# EAGLE design bui-001 (EAGLE 9.5.2)
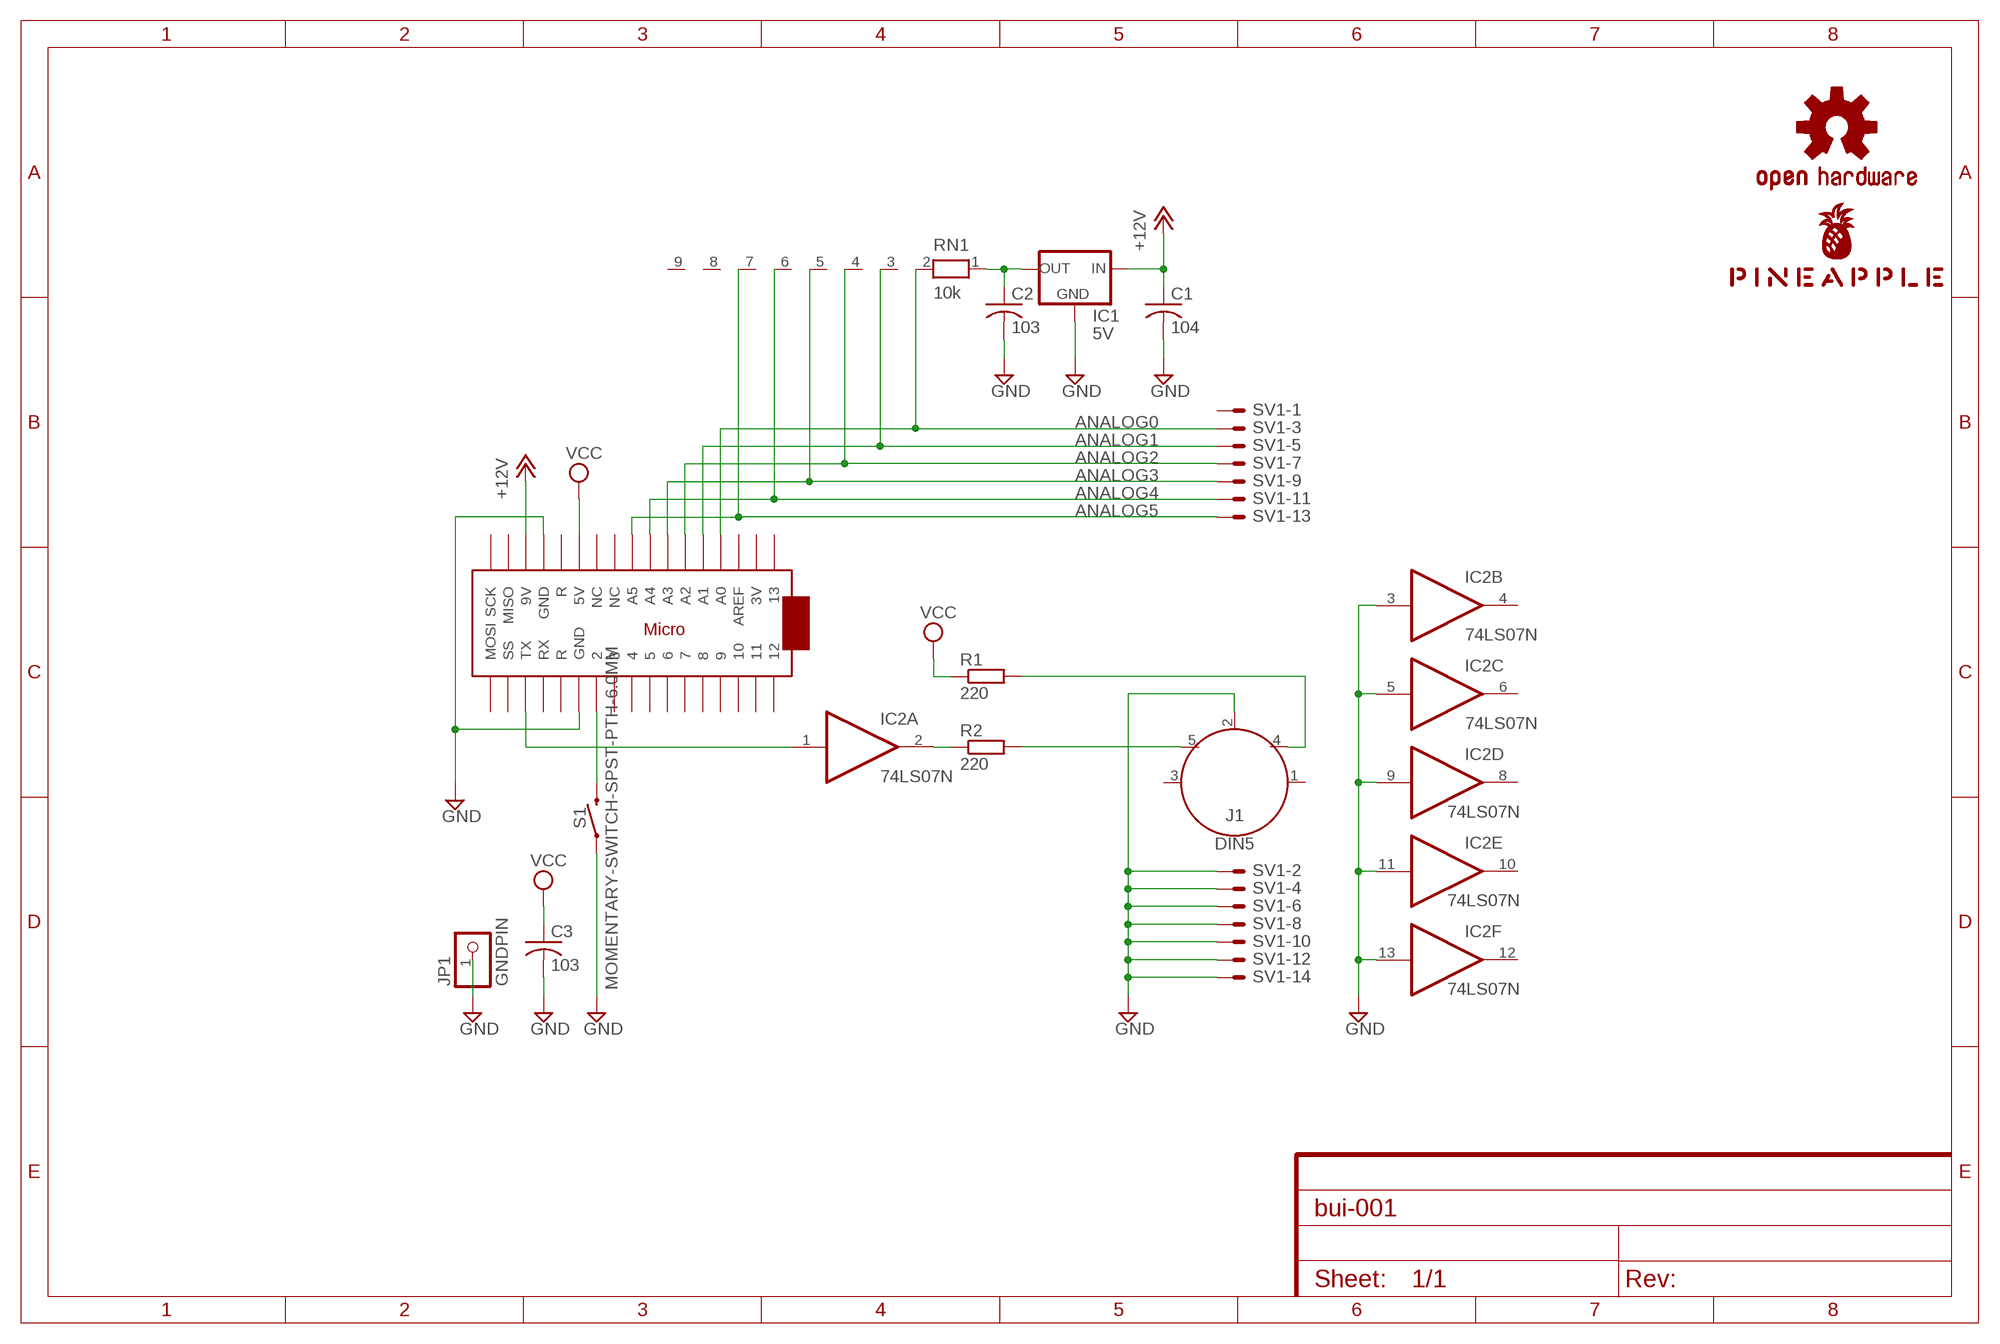
[diagram p0: schematic, sheet 1]

## Parts
C1  104  C-US025-025X050  [C025-025X050]
C2  103  C-US025-025X050  [C025-025X050]
C3  103  C-US025-025X050  [C025-025X050]
IC1  5V  78XXL  [78XXL]
IC2  74LS07N  [DIL14]
J1  DIN5  [DIN5-RA-PTH]
JP1  GNDPIN  PINHD-1X1  [1X01]
LOGO1  OSHW-LOGOS-COPPER  [OSHW-LOGO-S_COPPER]
MC1  ARDUINOMICRO  [ARDUINOMICRO]
R1  220  R-EU_0204/5  [0204/5]
R2  220  R-EU_0204/5  [0204/5]
RN1  10k  RN08  [RN-9]
S1  MOMENTARY-SWITCH-SPST-PTH-6.0MM  [TACTILE_SWITCH_PTH_6.0MM]
SV1  ML14LE  [ML14L]
U$1  PINEAPPLE450_SILK  [PINEAPPLE450_SILK]

## Nets
+12V [power]: C1.1 IC1.IN MC1.P$20(9V)
ANALOG0 [analog]: MC1.P$31(A0) RN1.2 SV1.3
ANALOG1 [analog]: MC1.P$30(A1) RN1.3 SV1.5
ANALOG2 [analog]: MC1.P$29(A2) RN1.4 SV1.7
ANALOG3 [analog]: MC1.P$28(A3) RN1.5 SV1.9
ANALOG4 [analog]: MC1.P$27(A4) RN1.6 SV1.11
ANALOG5 [analog]: MC1.P$26(A5) RN1.7 SV1.13
GND [gnd]: C1.2 C2.2 C3.2 IC1.GND IC2.3(B:I) IC2.5(C:I) IC2.9(D:I) IC2.11(E:I) IC2.13(F:I) J1.2 JP1.1 MC1.P$12(GND) MC1.P$21(GND) S1.1 SV1.2 SV1.4 SV1.6 SV1.8 SV1.10 SV1.12 SV1.14
N$1: MC1.P$11 S1.3
N$7: IC2.1(A:I) MC1.P$15(TX)
N$8: IC2.2(A:O) R2.1
N$9: J1.5 R2.2
N$10: J1.4 R1.2
VCC [power]: C3.1 MC1.P$23(5V) R1.1
VOUT [power]: C2.1 IC1.OUT RN1.1
Unconnected: IC2.4(B:O) IC2.6(C:O) IC2.8(D:O) IC2.10(E:O) IC2.12(F:O) J1.1 J1.3 MC1.P$1 MC1.P$2 MC1.P$3 MC1.P$4 MC1.P$5 MC1.P$6 MC1.P$7 MC1.P$8 MC1.P$9 MC1.P$10 MC1.P$13(R) MC1.P$14(RX) MC1.P$16(SS) MC1.P$17(MOSI) MC1.P$18(SCK) MC1.P$19(MISO) MC1.P$22(R) MC1.P$24(NC) MC1.P$25(NC) MC1.P$32(AREF) MC1.P$33(3V) MC1.P$34 RN1.8 RN1.9 SV1.1

## Power pins joined to a net without a drawn wire
GND: IC2.7(P:GND)
VCC: IC2.14(P:VCC)

## Library data of the parts
C1-C3 = rcl:C-US: CAPACITOR, American symbol
IC1 = v-reg:78XXL: VOLTAGE REGULATOR
IC2 = 74xx-us:74*07: Hex BUFFER, open collector high-voltage output
J1 = SparkFun-Connectors:DIN5: DIN5 Connector - Female Right Angle (frequently used as a MIDI Jack connector) This type of connector and cable is frequently used for transmitting midi data (musical instrument digital interface). It is what you usually see on a keyboard or set of electronic drums. Learn more here <https://en.wikipedia.org/wiki/MIDI>. For more information on the pinout and electrical specifications of MIDI communications, please see the following resource: https://www.midi.org/specifications/item/midi-din-electrical-specification Here is the connector we sell at SparkFun: MIDI Connector - Female Right Angle <https://www.sparkfun.com/products/9536> (PRT-09536) Datasheet <hhttp://www.sparkfun.com/datasheets/Prototyping/Connectors/MIDI-RA.pdf> It is used on this SparkFun product: SparkFun MIDI Shield <https://www.sparkfun.com/products/12898> (DEV-12898); PROD_ID: CONN-09481
JP1 = pinhead:PINHD-1X1: PIN HEADER
LOGO1 = SparkFun-Aesthetics:OSHW-LOGO: Open-Source Hardware (OSHW) Logo This logo indicates the piece of hardware it is found on incorporates a OSHW license and/or adheres to the definition of open source hardware found here: http://freedomdefined.org/OSHW
MC1 = adafruit:ARDUINOMICRO
R1 R2 = resistor:R-EU_: RESISTOR, European symbol
RN1 = resistor-net:RN08: RESISTOR NETWORK; OC_FARNELL: unknown; OC_NEWARK: unknown
S1 = SparkFun-Switches:MOMENTARY-SWITCH-SPST: Momentary Switch (Pushbutton) - SPST Normally-open (NO) SPST momentary switches (buttons, pushbuttons). Variants PTH-12MM - 12mm square, through-hole Momentary Pushbutton Switch - 12mm Square <https://www.sparkfun.com/products/9190> (COM-09190) PTH-6.0MM, PTH-6.0MM-KIT - 6.0mm square, through-hole Mini Pushbutton Switch <https://www.sparkfun.com/products/97> (COM-00097) KIT package intended for soldering kit's - only one side of pads' copper is exposed. PTH-RIGHT-ANGLE-KIT - Right-angle, through-hole Right Angle Tactile Button <https://www.sparkfun.com/products/10791> - Used on SparkFun BigTime Watch Kit <https://www.sparkfun.com/products/11734> SMD-12MM - 12mm square, surface-mount Tactile Button - SMD (12mm) <https://www.sparkfun.com/products/12993> (COM-12993) Used on SparkFun PicoBoard <https://www.sparkfun.com/products/11888> SMD-4.5MM - 4.5mm Square Trackball Switch Used on SparkFun Blackberry Trackballer Breakout <https://www.sparkfun.com/products/13169> SMD-4.6MMX2.8MM - 4.60mm x 2.80mm, surface mount Used on SparkFun SAMD21 Mini Breakout <https://www.sparkfun.com/products/13664> SMD-5.2MM, SMD-5.2-REDUNDANT - 5.2mm square, surface-mount Mini Pushbutton Switch - SMD <https://www.sparkfun.com/products/8720> (COM-08720) Used on Arduino Pro Mini <https://www.sparkfun.com/products/11114> REDUNDANT package connects both switch circuits together SMD-6.0X3.5MM - 6.0 x 3.5mm, surface mount Momentary Reset Switch SMD <https://www.sparkfun.com/products/8229> (COM-08229) SMD-6.2MM-TALL - 6.2mm square, surface mount Tactile Button - SMD (6mm) <https://www.sparkfun.com/products/12992> Used on SparkFun Digital Sandbox <https://www.sparkfun.com/products/12651> SMD-RIGHT-ANGLE - Right-angle, surface mount Used on SparkFun Block for Intel® Edison - Arduino <https://www.sparkfun.com/products/13036>; PROD_ID: SWCH-08441; SF_SKU: COM-00097
SV1 = con-ml:ML14LE: HARTING; OC_FARNELL: unknown; OC_NEWARK: unknown
U$1 = pineapple:PINEAPPLE450_SILK

## Net classes
0 default: width 0.152 mm, drill 0.152 mm, clearance 0.152 mm
1 gnd: width 0.61 mm, drill 0.152 mm, clearance 0.152 mm
2 power: width 0.61 mm, drill 0.152 mm, clearance 0.152 mm
3 analog: width 0.305 mm, drill 0.152 mm, clearance 0.152 mm

## Board
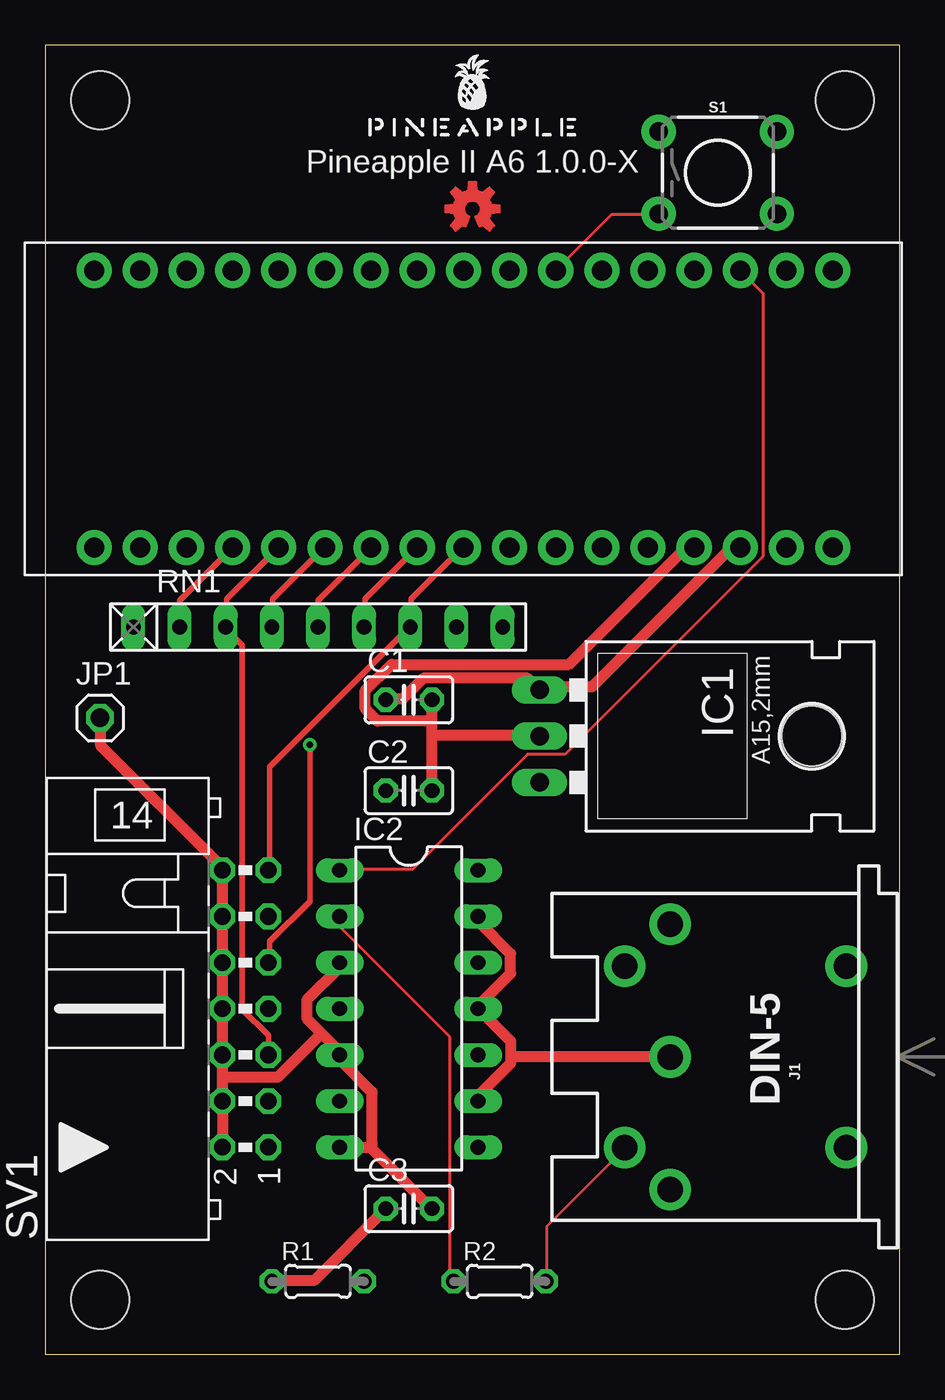
[diagram p1: board, top side]
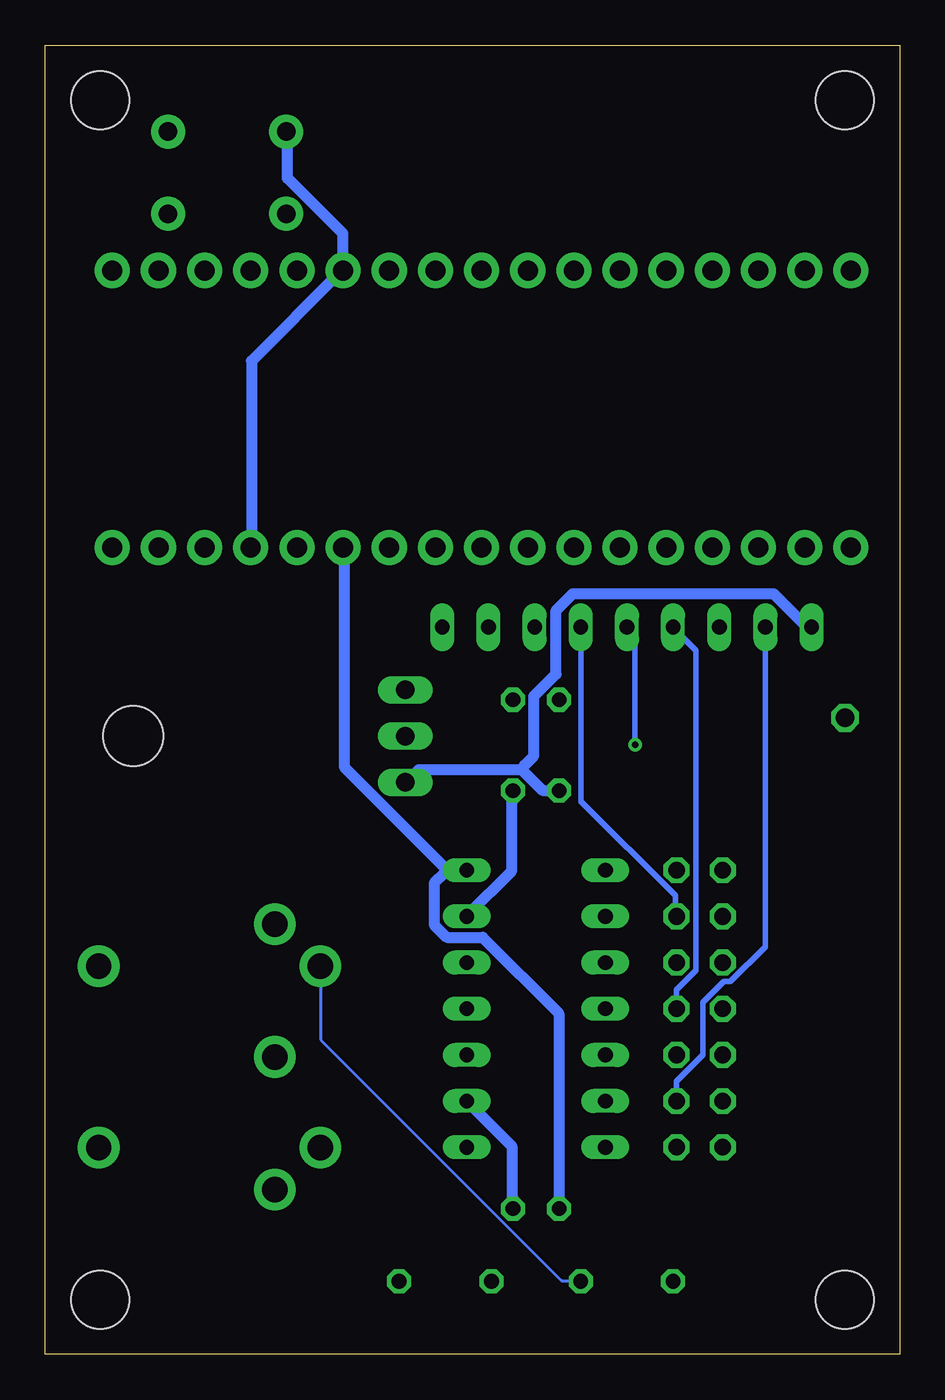
[diagram p2: board, bottom side, seen from below]

Size 47 x 72 mm. Coordinates in mm from the lower left corner, seen from the top.
Outline: 0,0 47,0 47,72 0,72 0,0
Copper layers (1*16): Top 0.035mm / dielectric 1.5mm / Bottom 0.035mm
Design rules "default": minimum track width 6mil, minimum drill 0.35mm, track to track 6mil, track to pad 6mil, pad to pad 6mil, via to via 6mil, smd to smd 6mil, copper to edge 40mil, drill to drill 6mil, minimum pad ring 10mil, minimum via ring 8mil, stop-mask expansion 4mil, vias tented up to drill 0mil, thermal gap 10mil
Holes 3.2 mm at 3,3 44,3 44,69 3,69

### Footprints (pad centres in the part's own frame; a part is rotated, then mirrored left to right if it is on the bottom)
C025-025X050 = drill 0.813 octagon: 1 -1.27,0; 2 1.27,0
78XXL = drill 1.016 long: GND 0,-3.81; IN -2.54,-3.81; OUT 2.54,-3.81 | hole 3.302: 0,11.176
DIL14 = drill 0.813 long: 1 -7.62,-3.81; 2 -5.08,-3.81; 3 -2.54,-3.81; 4 0,-3.81; 5 2.54,-3.81; 6 5.08,-3.81; 7 7.62,-3.81; 8 7.62,3.81; 9 5.08,3.81; 10 2.54,3.81; 11 0,3.81; 12 -2.54,3.81; 13 -5.08,3.81; 14 -7.62,3.81
DIN5-RA-PTH = drill 1.4 pad 2.286: 1 7.3,12.5; 2 0,12.5; 3 -7.3,12.5; 4 5,15; 5 -5,15; 6 -5,2.8; 7 5,2.8
1X01 = drill 1.016 octagon: 1 0,0
ARDUINOMICRO = drill 1.1 pad 1.93: P$1 -20.32,7.62; P$2 -17.78,7.62; P$3 -15.24,7.62; P$4 -12.7,7.62; P$5 -10.16,7.62; P$6 -7.62,7.62; P$7 -5.08,7.62; P$8 -2.54,7.62; P$9 0,7.62; P$10 2.54,7.62; P$11 5.08,7.62; P$12 12.7,-7.62; P$13 10.16,-7.62; P$14 12.7,7.62; P$15 15.24,7.62; P$16 17.78,7.62; P$17 20.32,7.62; P$18 20.32,-7.62; P$19 17.78,-7.62; P$20 15.24,-7.62; P$21 7.62,7.62; P$22 10.16,7.62; P$23 7.62,-7.62; P$24 5.08,-7.62; P$25 2.54,-7.62; P$26 0,-7.62; P$27 -2.54,-7.62; P$28 -5.08,-7.62; P$29 -7.62,-7.62; P$30 -10.16,-7.62; P$31 -12.7,-7.62; P$32 -15.24,-7.62; P$33 -17.78,-7.62; P$34 -20.32,-7.62
0204/5 = drill 0.813 octagon: 1 -2.54,0; 2 2.54,0
RN-9 = drill 0.813 long: 1 -10.16,0; 2 -7.62,0; 3 -5.08,0; 4 -2.54,0; 5 0,0; 6 2.54,0; 7 5.08,0; 8 7.62,0; 9 10.16,0
TACTILE_SWITCH_PTH_6.0MM = drill 1.016 pad 1.88: 1 -3.251,2.261; 2 3.251,2.261; 3 -3.251,-2.261; 4 3.251,-2.261
ML14L = drill 0.914 octagon: 1 -7.62,-1.27; 2 -7.62,1.27; 3 -5.08,-1.27; 4 -5.08,1.27; 5 -2.54,-1.27; 6 -2.54,1.27; 7 0,-1.27; 8 0,1.27; 9 2.54,-1.27; 10 2.54,1.27; 11 5.08,-1.27; 12 5.08,1.27; 13 7.62,-1.27; 14 7.62,1.27

### Placement (x,y rotation side)
C1  20,36 0 top
C2  20,31 0 top
C3  20,8 0 top
IC1  31,34 270 top
IC2  20,19 270 top
J1  46.87,16.35 90 top
JP1  3,35 0 top
LOGO1  23.5,63 0 top
MC1  23,52 0 top
R1  15,4 0 top
R2  25,4 0 top
RN1  15,40 0 top
S1  37,65 0 top
SV1  11,19 90 top
U$1  23.5,67 0 top

### Tracks (layer width: path | path; a pad name or v marks a point on that pad's centre or on a via)
+12V
  Top 0.61: C1.1 18.75,36.04 19.66,36.04 20.8,37.19 26.52,37.19 27.13,36.58 IC1.IN 27.43,36.73 30.1,36.73 37.72,44.35 38.18,44.35 MC1.P$20
ANALOG0
  Top 0.305: RN1.2 7.39,41.45 10.29,44.35 MC1.P$31
  Bottom 0.305: SV1.3 12.27,13.95 12.27,15.01 10.82,16.46 10.82,19.36 9.68,20.5 9.3,20.5 7.39,22.4 7.39,39.93 RN1.2
ANALOG1
  Top 0.305: MC1.P$30 12.8,44.35 9.98,41.53 9.98,40.01 RN1.3 9.98,39.85 10.82,39.01 10.82,18.97 12.27,17.53 12.27,16.54 SV1.5
ANALOG2
  Top 0.305: RN1.4 12.5,40.01 12.5,41.53 15.32,44.35 MC1.P$29
  Bottom 0.305: SV1.7 12.27,19.05 12.27,20.04 11.2,21.11 11.2,38.71 12.42,39.93 RN1.4
ANALOG3  (via drill 0.35)
  Top 0.305: RN1.5 15.01,41.45 17.91,44.35 MC1.P$28 | v14.55,33.53 14.55,24.92 12.34,22.71 12.34,21.57 SV1.9
  Bottom 0.305: v14.55,33.53 14.55,39.55 14.94,39.93 RN1.5
ANALOG4
  Top 0.305: RN1.6 17.6,40.01 17.6,41.53 20.42,44.35 MC1.P$27
  Bottom 0.305: SV1.11 12.34,24.16 12.34,25.22 17.53,30.4 17.53,39.93 RN1.6
ANALOG5
  Top 0.305: MC1.P$26 22.94,44.35 20.12,41.53 20.12,40.01 RN1.7 19.96,39.93 12.34,32.31 12.34,26.67 SV1.13
GND
  Top 0.61: 17.91,11.35 16.23,11.35 IC2.7 | 17.91,11.35 C3.2 | 17.91,11.35 17.98,11.58 17.98,14.4 16.23,16.15 16.23,16.46 IC2.5 16.08,16.76 15.2,17.64 | 15.2,17.64 14.4,18.44 14.4,19.51 16.15,21.26 16.15,21.49 IC2.3 | SV1.2 9.75,11.43 9.75,13.87 SV1.4 9.75,14.17 9.75,15.24 | 9.75,15.24 9.75,16.46 SV1.6 9.75,16.76 9.75,18.97 SV1.8 9.75,19.28 9.75,21.49 SV1.10 9.75,21.79 9.75,24.08 SV1.12 9.75,24.38 9.75,26.59 SV1.14 9.6,26.9 3.05,33.45 3.05,34.98 JP1.1 | 15.2,17.64 12.8,15.24 9.75,15.24 | 21.26,34.82 21.26,35.97 C1.2 | 21.26,34.82 21.26,34.06 | 21.26,34.06 21.26,31.01 C2.2 | 21.26,34.06 27.13,34.06 IC1.GND | 25.6,16.38 25.6,17.22 23.85,18.97 IC2.11 23.93,19.28 25.6,20.95 25.6,22.02 23.85,23.77 23.85,24.08 IC2.13 | 25.6,16.38 25.6,16 23.85,14.25 23.85,13.95 IC2.9 | 25.6,16.38 34.37,16.38 J1.2 | 21.26,34.82 18.29,34.82 17.6,35.51 17.6,36.5 19.05,37.95 28.8,37.95 35.2,44.35 35.66,44.35 MC1.P$12
  Bottom 0.61: S1.1 33.68,67.21 33.68,64.69 30.63,61.65 30.63,59.66 MC1.P$21 30.86,59.44 35.66,54.63 35.66,44.42 MC1.P$12 | C2.2 21.34,30.94 21.34,26.59 23.77,24.16 IC2.13 | C3.2 21.34,8 21.34,11.43 23.77,13.87 IC2.9
N$1
  Top 0.152: S1.3 33.68,62.71 31.17,62.71 28.12,59.66 MC1.P$11
N$7
  Top 0.152: IC2.1 16.23,26.67 20.19,26.67 26.52,32.99 28.57,32.99 39.47,43.89 39.47,58.37 38.25,59.59 MC1.P$15
N$8
  Top 0.152: IC2.2 16.23,24.08 16.23,23.47 22.25,17.45 22.25,4.19 22.4,4.04 R2.1
N$9
  Top 0.152: R2.2 27.58,4.04 27.58,7.01 31.85,11.28 J1.5
N$10
  Bottom 0.152: R1.2 17.6,4.04 18.59,4.04 31.85,17.3 31.85,21.34 J1.4
VCC
  Top 0.61: R1.1 12.5,4.04 14.78,4.04 18.67,7.92 C3.1
  Bottom 0.61: MC1.P$23 30.56,44.35 30.56,32.31 24.92,26.67 23.85,26.67 IC2.14 25.07,26.44 25.6,25.91 25.6,23.62 24.92,22.94 22.94,22.94 18.75,18.75 18.75,8 C3.1
VOUT
  Bottom 0.61: 20.8,32.16 19.66,31.01 18.75,31.01 C2.1 | 20.8,32.16 26.44,32.16 27.13,31.47 IC1.OUT | RN1.1 4.88,40.01 5.11,40.01 6.93,41.83 17.98,41.83 18.9,40.92 18.9,37.41 20.12,36.2 20.12,32.92 20.65,32.38 20.8,32.16

### Text on the board
tPlace: Pineapple II A6 1.0.0-X